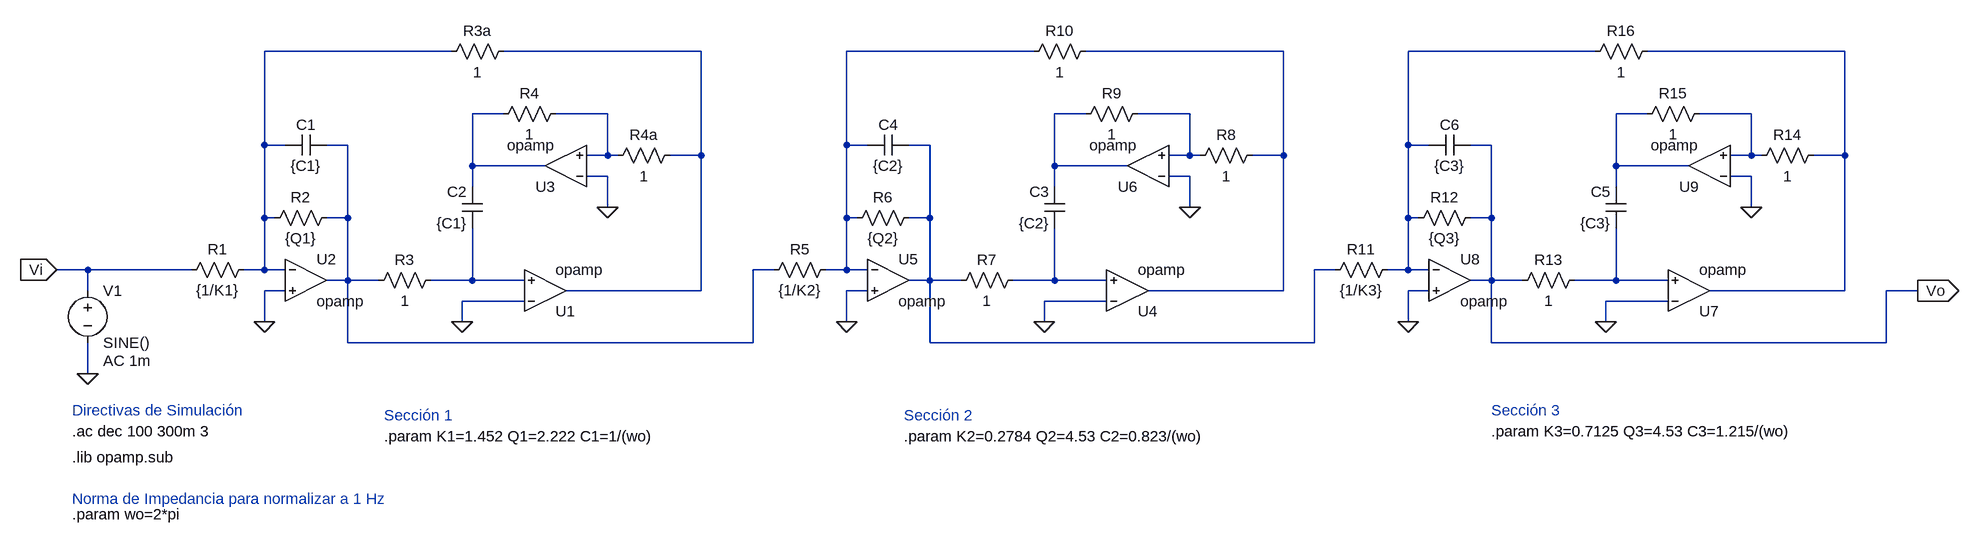
[diagram p0: schematic TS4_bis.asc]
TS4_bis.asc, the LTspice schematic file:
Version 4
SHEET 1 2396 680
WIRE 48 -224 -240 -224
WIRE 432 -224 128 -224
WIRE 944 -224 656 -224
WIRE 1328 -224 1024 -224
WIRE 1808 -224 1520 -224
WIRE 2192 -224 1888 -224
WIRE 128 -128 80 -128
WIRE 288 -128 208 -128
WIRE 1024 -128 976 -128
WIRE 1184 -128 1104 -128
WIRE 1888 -128 1840 -128
WIRE 2048 -128 1968 -128
WIRE -240 -80 -240 -224
WIRE -208 -80 -240 -80
WIRE -112 -80 -144 -80
WIRE 656 -80 656 -224
WIRE 688 -80 656 -80
WIRE 784 -80 752 -80
WIRE 1520 -80 1520 -224
WIRE 1552 -80 1520 -80
WIRE 1648 -80 1616 -80
WIRE 288 -64 288 -128
WIRE 288 -64 256 -64
WIRE 304 -64 288 -64
WIRE 432 -64 432 -224
WIRE 432 -64 384 -64
WIRE 1184 -64 1184 -128
WIRE 1184 -64 1152 -64
WIRE 1200 -64 1184 -64
WIRE 1328 -64 1328 -224
WIRE 1328 -64 1280 -64
WIRE 2048 -64 2048 -128
WIRE 2048 -64 2016 -64
WIRE 2064 -64 2048 -64
WIRE 2192 -64 2192 -224
WIRE 2192 -64 2144 -64
WIRE 80 -48 80 -128
WIRE 192 -48 80 -48
WIRE 976 -48 976 -128
WIRE 1088 -48 976 -48
WIRE 1840 -48 1840 -128
WIRE 1952 -48 1840 -48
WIRE 288 -32 256 -32
WIRE 1184 -32 1152 -32
WIRE 2048 -32 2016 -32
WIRE 80 -16 80 -48
WIRE 976 -16 976 -48
WIRE 1840 -16 1840 -48
WIRE 288 16 288 -32
WIRE 1184 16 1184 -32
WIRE 2048 16 2048 -32
WIRE -240 32 -240 -80
WIRE -224 32 -240 32
WIRE -112 32 -112 -80
WIRE -112 32 -144 32
WIRE 656 32 656 -80
WIRE 672 32 656 32
WIRE 784 32 784 -80
WIRE 784 32 752 32
WIRE 1520 32 1520 -80
WIRE 1536 32 1520 32
WIRE 1648 32 1648 -80
WIRE 1648 32 1616 32
WIRE -512 112 -560 112
WIRE -352 112 -512 112
WIRE -240 112 -240 32
WIRE -240 112 -272 112
WIRE -208 112 -240 112
WIRE 544 112 512 112
WIRE 656 112 656 32
WIRE 656 112 624 112
WIRE 688 112 656 112
WIRE 1408 112 1376 112
WIRE 1520 112 1520 32
WIRE 1520 112 1488 112
WIRE 1552 112 1520 112
WIRE -112 128 -112 32
WIRE -112 128 -144 128
WIRE -64 128 -112 128
WIRE 80 128 80 48
WIRE 80 128 16 128
WIRE 160 128 80 128
WIRE 784 128 784 32
WIRE 784 128 752 128
WIRE 832 128 784 128
WIRE 976 128 976 48
WIRE 976 128 912 128
WIRE 1056 128 976 128
WIRE 1648 128 1648 32
WIRE 1648 128 1616 128
WIRE 1696 128 1648 128
WIRE 1840 128 1840 48
WIRE 1840 128 1776 128
WIRE 1920 128 1840 128
WIRE -512 144 -512 112
WIRE -208 144 -240 144
WIRE 432 144 432 -64
WIRE 432 144 224 144
WIRE 688 144 656 144
WIRE 1328 144 1328 -64
WIRE 1328 144 1120 144
WIRE 1552 144 1520 144
WIRE 2192 144 2192 -64
WIRE 2192 144 1984 144
WIRE 2304 144 2256 144
WIRE 160 160 64 160
WIRE 1056 160 960 160
WIRE 1920 160 1824 160
WIRE -240 192 -240 144
WIRE 64 192 64 160
WIRE 656 192 656 144
WIRE 960 192 960 160
WIRE 1520 192 1520 144
WIRE 1824 192 1824 160
WIRE -112 224 -112 128
WIRE 512 224 512 112
WIRE 512 224 -112 224
WIRE 784 224 784 128
WIRE 1376 224 1376 112
WIRE 1376 224 784 224
WIRE 1648 224 1648 128
WIRE 2256 224 2256 144
WIRE 2256 224 1648 224
WIRE -512 272 -512 224
FLAG 64 192 0
FLAG -240 192 0
FLAG 288 16 0
FLAG -512 272 0
FLAG -560 112 Vi
IOPIN -560 112 In
FLAG 960 192 0
FLAG 656 192 0
FLAG 1184 16 0
FLAG 1824 192 0
FLAG 1520 192 0
FLAG 2048 16 0
FLAG 2304 144 Vo
IOPIN 2304 144 Out
SYMBOL OpAmps\\opamp 192 208 M180
SYMATTR InstName U1
SYMBOL OpAmps\\opamp -176 64 R0
SYMATTR InstName U2
SYMBOL OpAmps\\opamp 224 16 R180
SYMATTR InstName U3
SYMBOL res -256 96 R90
WINDOW 0 0 56 VBottom 2
WINDOW 3 32 56 VTop 2
SYMATTR InstName R1
SYMATTR Value {1/K1}
SYMBOL res -128 16 R90
WINDOW 0 0 56 VBottom 2
WINDOW 3 32 56 VTop 2
SYMATTR InstName R2
SYMATTR Value {Q1}
SYMBOL res 32 112 R90
WINDOW 0 0 56 VBottom 2
WINDOW 3 32 56 VTop 2
SYMATTR InstName R3
SYMATTR Value 1
SYMBOL res 400 -80 R90
WINDOW 0 0 56 VBottom 2
WINDOW 3 32 56 VTop 2
SYMATTR InstName R4a
SYMATTR Value 1
SYMBOL res 224 -144 R90
WINDOW 0 0 56 VBottom 2
WINDOW 3 32 56 VTop 2
SYMATTR InstName R4
SYMATTR Value 1
SYMBOL res 144 -240 R90
WINDOW 0 0 56 VBottom 2
WINDOW 3 32 56 VTop 2
SYMATTR InstName R3a
SYMATTR Value 1
SYMBOL cap 96 48 R180
WINDOW 0 24 56 Left 2
WINDOW 3 24 8 Left 2
SYMATTR InstName C2
SYMATTR Value {C1}
SYMBOL cap -144 -96 R90
WINDOW 0 0 32 VBottom 2
WINDOW 3 32 32 VTop 2
SYMATTR InstName C1
SYMATTR Value {C1}
SYMBOL voltage -512 128 R0
WINDOW 123 24 124 Left 2
WINDOW 39 0 0 Left 0
SYMATTR Value2 AC 1m
SYMATTR InstName V1
SYMATTR Value SINE()
SYMBOL OpAmps\\opamp 1088 208 M180
SYMATTR InstName U4
SYMBOL OpAmps\\opamp 720 64 R0
SYMATTR InstName U5
SYMBOL OpAmps\\opamp 1120 16 R180
SYMATTR InstName U6
SYMBOL res 640 96 R90
WINDOW 0 0 56 VBottom 2
WINDOW 3 32 56 VTop 2
SYMATTR InstName R5
SYMATTR Value {1/K2}
SYMBOL res 768 16 R90
WINDOW 0 0 56 VBottom 2
WINDOW 3 32 56 VTop 2
SYMATTR InstName R6
SYMATTR Value {Q2}
SYMBOL res 928 112 R90
WINDOW 0 0 56 VBottom 2
WINDOW 3 32 56 VTop 2
SYMATTR InstName R7
SYMATTR Value 1
SYMBOL res 1296 -80 R90
WINDOW 0 0 56 VBottom 2
WINDOW 3 32 56 VTop 2
SYMATTR InstName R8
SYMATTR Value 1
SYMBOL res 1120 -144 R90
WINDOW 0 0 56 VBottom 2
WINDOW 3 32 56 VTop 2
SYMATTR InstName R9
SYMATTR Value 1
SYMBOL res 1040 -240 R90
WINDOW 0 0 56 VBottom 2
WINDOW 3 32 56 VTop 2
SYMATTR InstName R10
SYMATTR Value 1
SYMBOL cap 992 48 R180
WINDOW 0 24 56 Left 2
WINDOW 3 24 8 Left 2
SYMATTR InstName C3
SYMATTR Value {C2}
SYMBOL cap 752 -96 R90
WINDOW 0 0 32 VBottom 2
WINDOW 3 32 32 VTop 2
SYMATTR InstName C4
SYMATTR Value {C2}
SYMBOL OpAmps\\opamp 1952 208 M180
SYMATTR InstName U7
SYMBOL OpAmps\\opamp 1584 64 R0
SYMATTR InstName U8
SYMBOL OpAmps\\opamp 1984 16 R180
SYMATTR InstName U9
SYMBOL res 1504 96 R90
WINDOW 0 0 56 VBottom 2
WINDOW 3 32 56 VTop 2
SYMATTR InstName R11
SYMATTR Value {1/K3}
SYMBOL res 1632 16 R90
WINDOW 0 0 56 VBottom 2
WINDOW 3 32 56 VTop 2
SYMATTR InstName R12
SYMATTR Value {Q3}
SYMBOL res 1792 112 R90
WINDOW 0 0 56 VBottom 2
WINDOW 3 32 56 VTop 2
SYMATTR InstName R13
SYMATTR Value 1
SYMBOL res 2160 -80 R90
WINDOW 0 0 56 VBottom 2
WINDOW 3 32 56 VTop 2
SYMATTR InstName R14
SYMATTR Value 1
SYMBOL res 1984 -144 R90
WINDOW 0 0 56 VBottom 2
WINDOW 3 32 56 VTop 2
SYMATTR InstName R15
SYMATTR Value 1
SYMBOL res 1904 -240 R90
WINDOW 0 0 56 VBottom 2
WINDOW 3 32 56 VTop 2
SYMATTR InstName R16
SYMATTR Value 1
SYMBOL cap 1856 48 R180
WINDOW 0 24 56 Left 2
WINDOW 3 24 8 Left 2
SYMATTR InstName C5
SYMATTR Value {C3}
SYMBOL cap 1616 -96 R90
WINDOW 0 0 32 VBottom 2
WINDOW 3 32 32 VTop 2
SYMATTR InstName C6
SYMATTR Value {C3}
TEXT -536 400 Left 2 !.lib opamp.sub
TEXT -536 360 Left 2 !.ac dec 100 300m 3
TEXT -56 368 Left 2 !.param K1=1.452 Q1=2.222 C1=1/(wo)
TEXT -536 488 Left 2 !.param wo=2*pi
TEXT -536 328 Left 2 ;Directivas de Simulación
TEXT -56 336 Left 2 ;Sección 1
TEXT -536 464 Left 2 ;Norma de Impedancia para normalizar a 1 Hz
TEXT 744 368 Left 2 !.param K2=0.2784 Q2=4.53 C2=0.823/(wo)
TEXT 744 336 Left 2 ;Sección 2
TEXT 1648 360 Left 2 !.param K3=0.7125 Q3=4.53 C3=1.215/(wo)
TEXT 1648 328 Left 2 ;Sección 3

The netlist it stands for:
* TS4_bis.asc
XU1 0 N015 N002 opamp Aol=100K GBW=10Meg  ; pins invin noninvin out
XU2 N001 0 N013 opamp Aol=100K GBW=10Meg  ; pins invin noninvin out
XU3 0 N008 N007 opamp Aol=100K GBW=10Meg  ; pins invin noninvin out
R1 N001 Vi {1/K1}
R2 N013 N001 {Q1}
R3 N015 N013 1
R4a N002 N008 1
R4 N008 N007 1
R3a N002 N001 1
C2 N015 N007 {C1}
C1 N013 N001 {C1}
V1 Vi 0 SINE() AC 1m
XU4 0 N016 N004 opamp Aol=100K GBW=10Meg  ; pins invin noninvin out
XU5 N003 0 N014 opamp Aol=100K GBW=10Meg  ; pins invin noninvin out
XU6 0 N010 N009 opamp Aol=100K GBW=10Meg  ; pins invin noninvin out
R5 N003 N013 {1/K2}
R6 N014 N003 {Q2}
R7 N016 N014 1
R8 N004 N010 1
R9 N010 N009 1
R10 N004 N003 1
C3 N016 N009 {C2}
C4 N014 N003 {C2}
XU7 0 N017 N006 opamp Aol=100K GBW=10Meg  ; pins invin noninvin out
XU8 N005 0 Vo opamp Aol=100K GBW=10Meg  ; pins invin noninvin out
XU9 0 N012 N011 opamp Aol=100K GBW=10Meg  ; pins invin noninvin out
R11 N005 N014 {1/K3}
R12 Vo N005 {Q3}
R13 N017 Vo 1
R14 N006 N012 1
R15 N012 N011 1
R16 N006 N005 1
C5 N017 N011 {C3}
C6 Vo N005 {C3}
.lib opamp.sub
.ac dec 100 300m 3
.param K1=1.452 Q1=2.222 C1=1/(wo)
.param wo=2*pi
* Directivas de Simulación
* Sección 1
* Norma de Impedancia para normalizar a 1 Hz
.param K2=0.2784 Q2=4.53 C2=0.823/(wo)
* Sección 2
.param K3=0.7125 Q3=4.53 C3=1.215/(wo)
* Sección 3
.backanno
.end

* Results of the author's LTspice run, read from the files saved beside the schematic
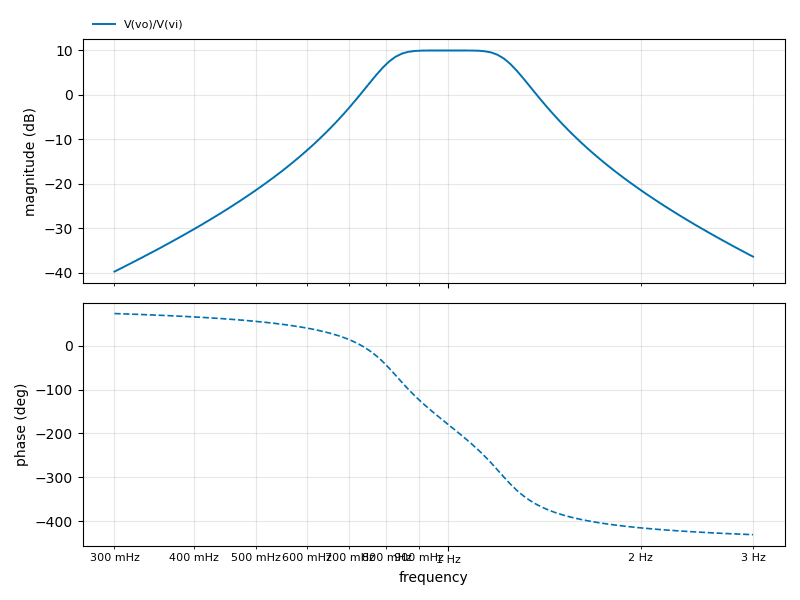
[diagram p1: AC Analysis of TS4_bis.asc, plotted from the saved traces]
* AC Analysis, 1 run:
*   V(vo)/V(vi): -39.73 dB at 300 mHz, -36.37 dB at 3 Hz, peak 10.00 dB at 970.8 mHz, 3 dB below the peak at 800.5 mHz and 1.25 Hz